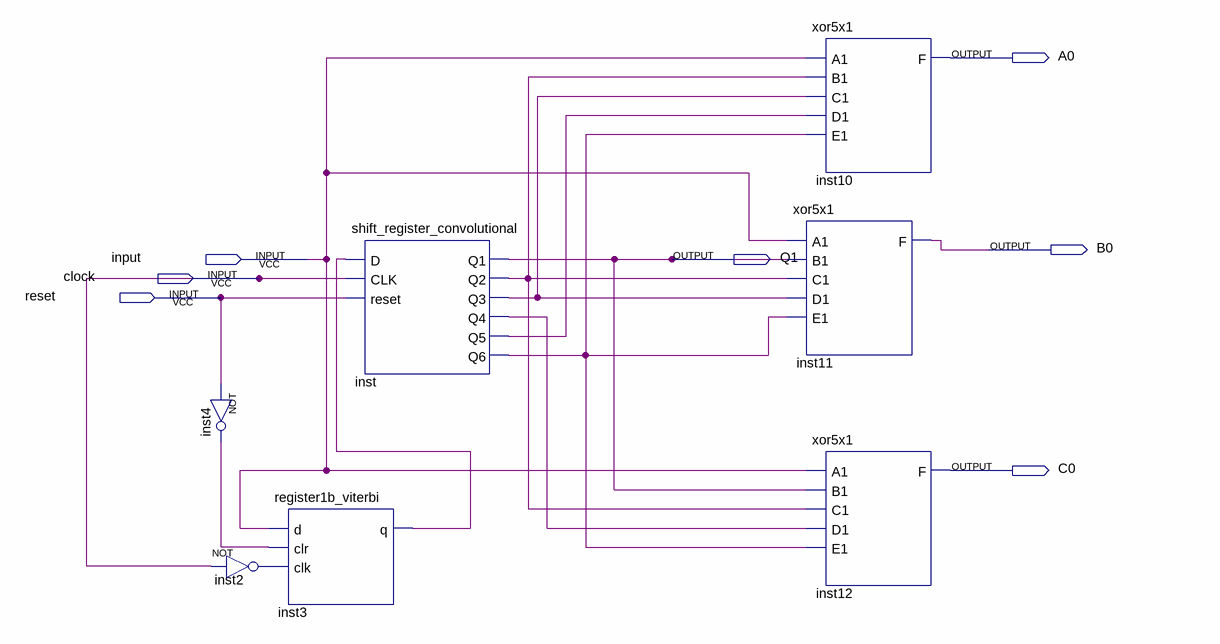
[diagram p0: schematic sheet]
// Quartus schematic ccEncoder.bdf as structural Verilog: 7 symbols, 7 pins
module ccEncoder (
  input  \input ,
  input  clock,
  input  reset,
  output A0,
  output B0,
  output Q1,
  output C0
);

  wire inst2_out, inst3_q, inst4_out, inst_q2, inst_q3, inst_q4, inst_q5, inst_q6;

  not inst4 (inst4_out, reset);
  not inst2 (inst2_out, clock);
  register1b_viterbi inst3 (.d(\input ), .clr(inst4_out), .clk(inst2_out), .q(inst3_q));
  shift_register_convolutional inst (
    .D(inst3_q), .CLK(clock), .reset(reset), .Q1(Q1), .Q2(inst_q2), .Q3(inst_q3), .Q4(inst_q4), .Q5(inst_q5),
    .Q6(inst_q6));
  xor5x1 inst10 (.A1(\input ), .B1(inst_q2), .C1(inst_q3), .D1(inst_q5), .E1(inst_q6), .F(A0));
  xor5x1 inst11 (.A1(\input ), .B1(Q1), .C1(inst_q2), .D1(inst_q3), .E1(inst_q6), .F(B0));
  xor5x1 inst12 (.A1(\input ), .B1(Q1), .C1(inst_q2), .D1(inst_q4), .E1(inst_q6), .F(C0));
endmodule
